# Altium schematic sheet [08] - FTDI.SchDoc: DOCUMENT TITLE
size A4; Organization: Tor Brodtkorb; Address1: Frode Rinnans veg 193; Address2: 7050 Trondheim; DocumentNumber: 6598; Revision: 1.0; SheetNumber: 1; SheetTotal: 1
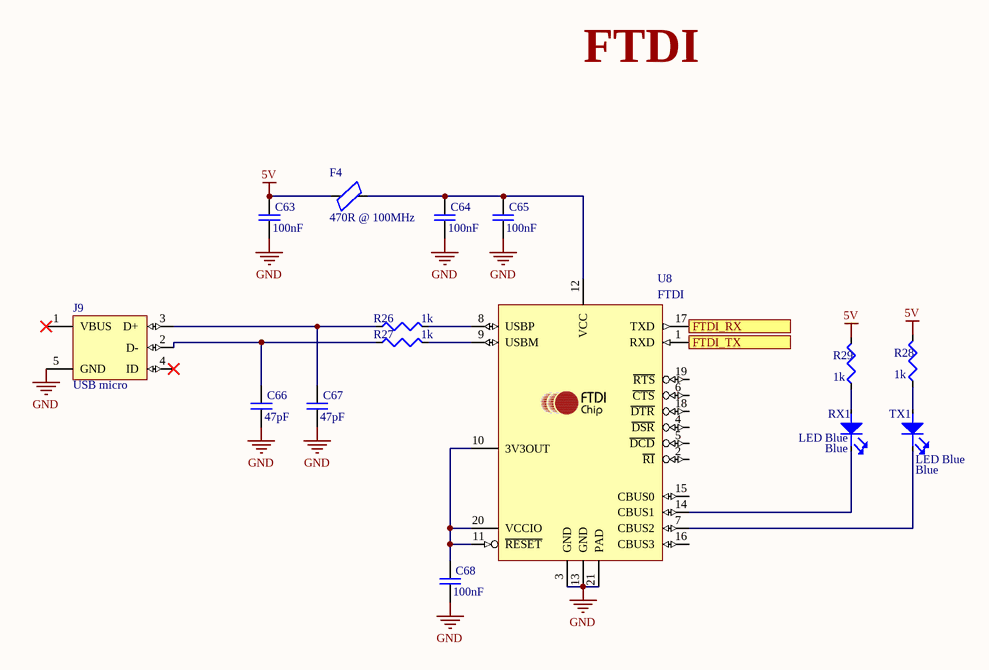
[diagram p0: [08] - FTDI.SchDoc]

## Parts
C63  value 100nF  [C0603]  (hidden comment: 02016D104KAT2A)
C64  value 100nF  [C0603]  (hidden comment: 02016D104KAT2A)
C65  value 100nF  [C0603]  (hidden comment: 02016D104KAT2A)
C66  value 47pF  [C0603]  (hidden comment: 02016D104KAT2A)
C67  value 47pF  [C0603]  (hidden comment: 02016D104KAT2A)
C68  value 100nF  [C0603]  (hidden comment: 02016D104KAT2A)
F4  value 470R @ 100MHz  [Ferrite bead 0603]  (hidden comment: BLM18AG121SN1D)
J9  USB micro  [USB micro]
R26  value 1k  [R0603]  (hidden comment: CPF-A-0603B100KE1)
R27  value 1k  [R0603]  (hidden comment: CPF-A-0603B100KE1)
R28  value 1k  [R0603]  (hidden comment: CPF-A-0603B100KE1)
R29  value 1k  [R0603]  (hidden comment: CPF-A-0603B100KE1)
RX1  LED Blue  Color: Blue  [L0603 BLUE]
TX1  LED Blue  Color: Blue  [L0603 BLUE]
U8  FTDI  [FT231XQ-R]

## Ports
FTDI_RX (out), FTDI_TX (in)

## Nets
5V: C63.2 F4.1 R28.2 R29.2
GND: C63.1 C64.1 C65.1 C66.1 C67.1 C68.1 J9.5(GND) U8.3(GND) U8.13(GND) U8.21(PAD)
FTDI_RX: U8.17(TXD) ; port FTDI_RX
FTDI_TX: U8.1(RXD) ; port FTDI_TX
NetC64_2: C64.2 C65.2 F4.2 U8.12(VCC)
NetC66_2: C66.2 J9.2(D-) R27.1
NetC67_2: C67.2 J9.3(D+) R26.1
NetC68_2: C68.2 U8.10(3V3OUT) U8.11(~{RESET}) U8.20(VCCIO)
NetR26_2: R26.2 U8.8(USBP)
NetR27_2: R27.2 U8.9(USBM)
NetR28_1: R28.1 TX1.1
NetR29_1: R29.1 RX1.1
NetRX1_2: RX1.2 U8.14(CBUS1)
NetTX1_2: TX1.2 U8.7(CBUS2)

Not connected (* = marked no-connect by the designer): J9 1(VBUS)* 4(ID)*; U8 2(~{RI}) 4(~{DSR}) 5(~{DCD}) 6(~{CTS}) 15(CBUS0) 16(CBUS3) 18(~{DTR}) 19(~{RTS})

## Notes on the sheet
- FTDI
- Title
- Size:
- Date:
- A4
- Number:
- Time:
- Revision:
- Sheet
- of
- File:

## Library data of the parts
C63-C68 = 02016D104KAT2A: C0603
F4 = BLM18AG121SN1D: Ferrite bead 0603
J9 = 47590-0001: Supplier Part Number 1: 1568022; Supplier 1: Farnell
R26-R29 = CPF-A-0603B100KE1: R0603
RX1 TX1 = HSMG-C199: LED 0603 Blue
U8 = FT231XQ-R: USB to RS-232 converter; Supplier Part Number 1: 2081330; Supplier 1: Farnell